# EasyEDA Pro project ProPrj_承载我所有幻想的键盘_2025-02-09.epro, schematic 11-Schematic
Create Date: 2024-01-15; Page Name: P1; Project Name: 智能旋钮; Schematic Name: Schematic2_1; Update Date: 2024-01-15; Company: 嘉立创EDA
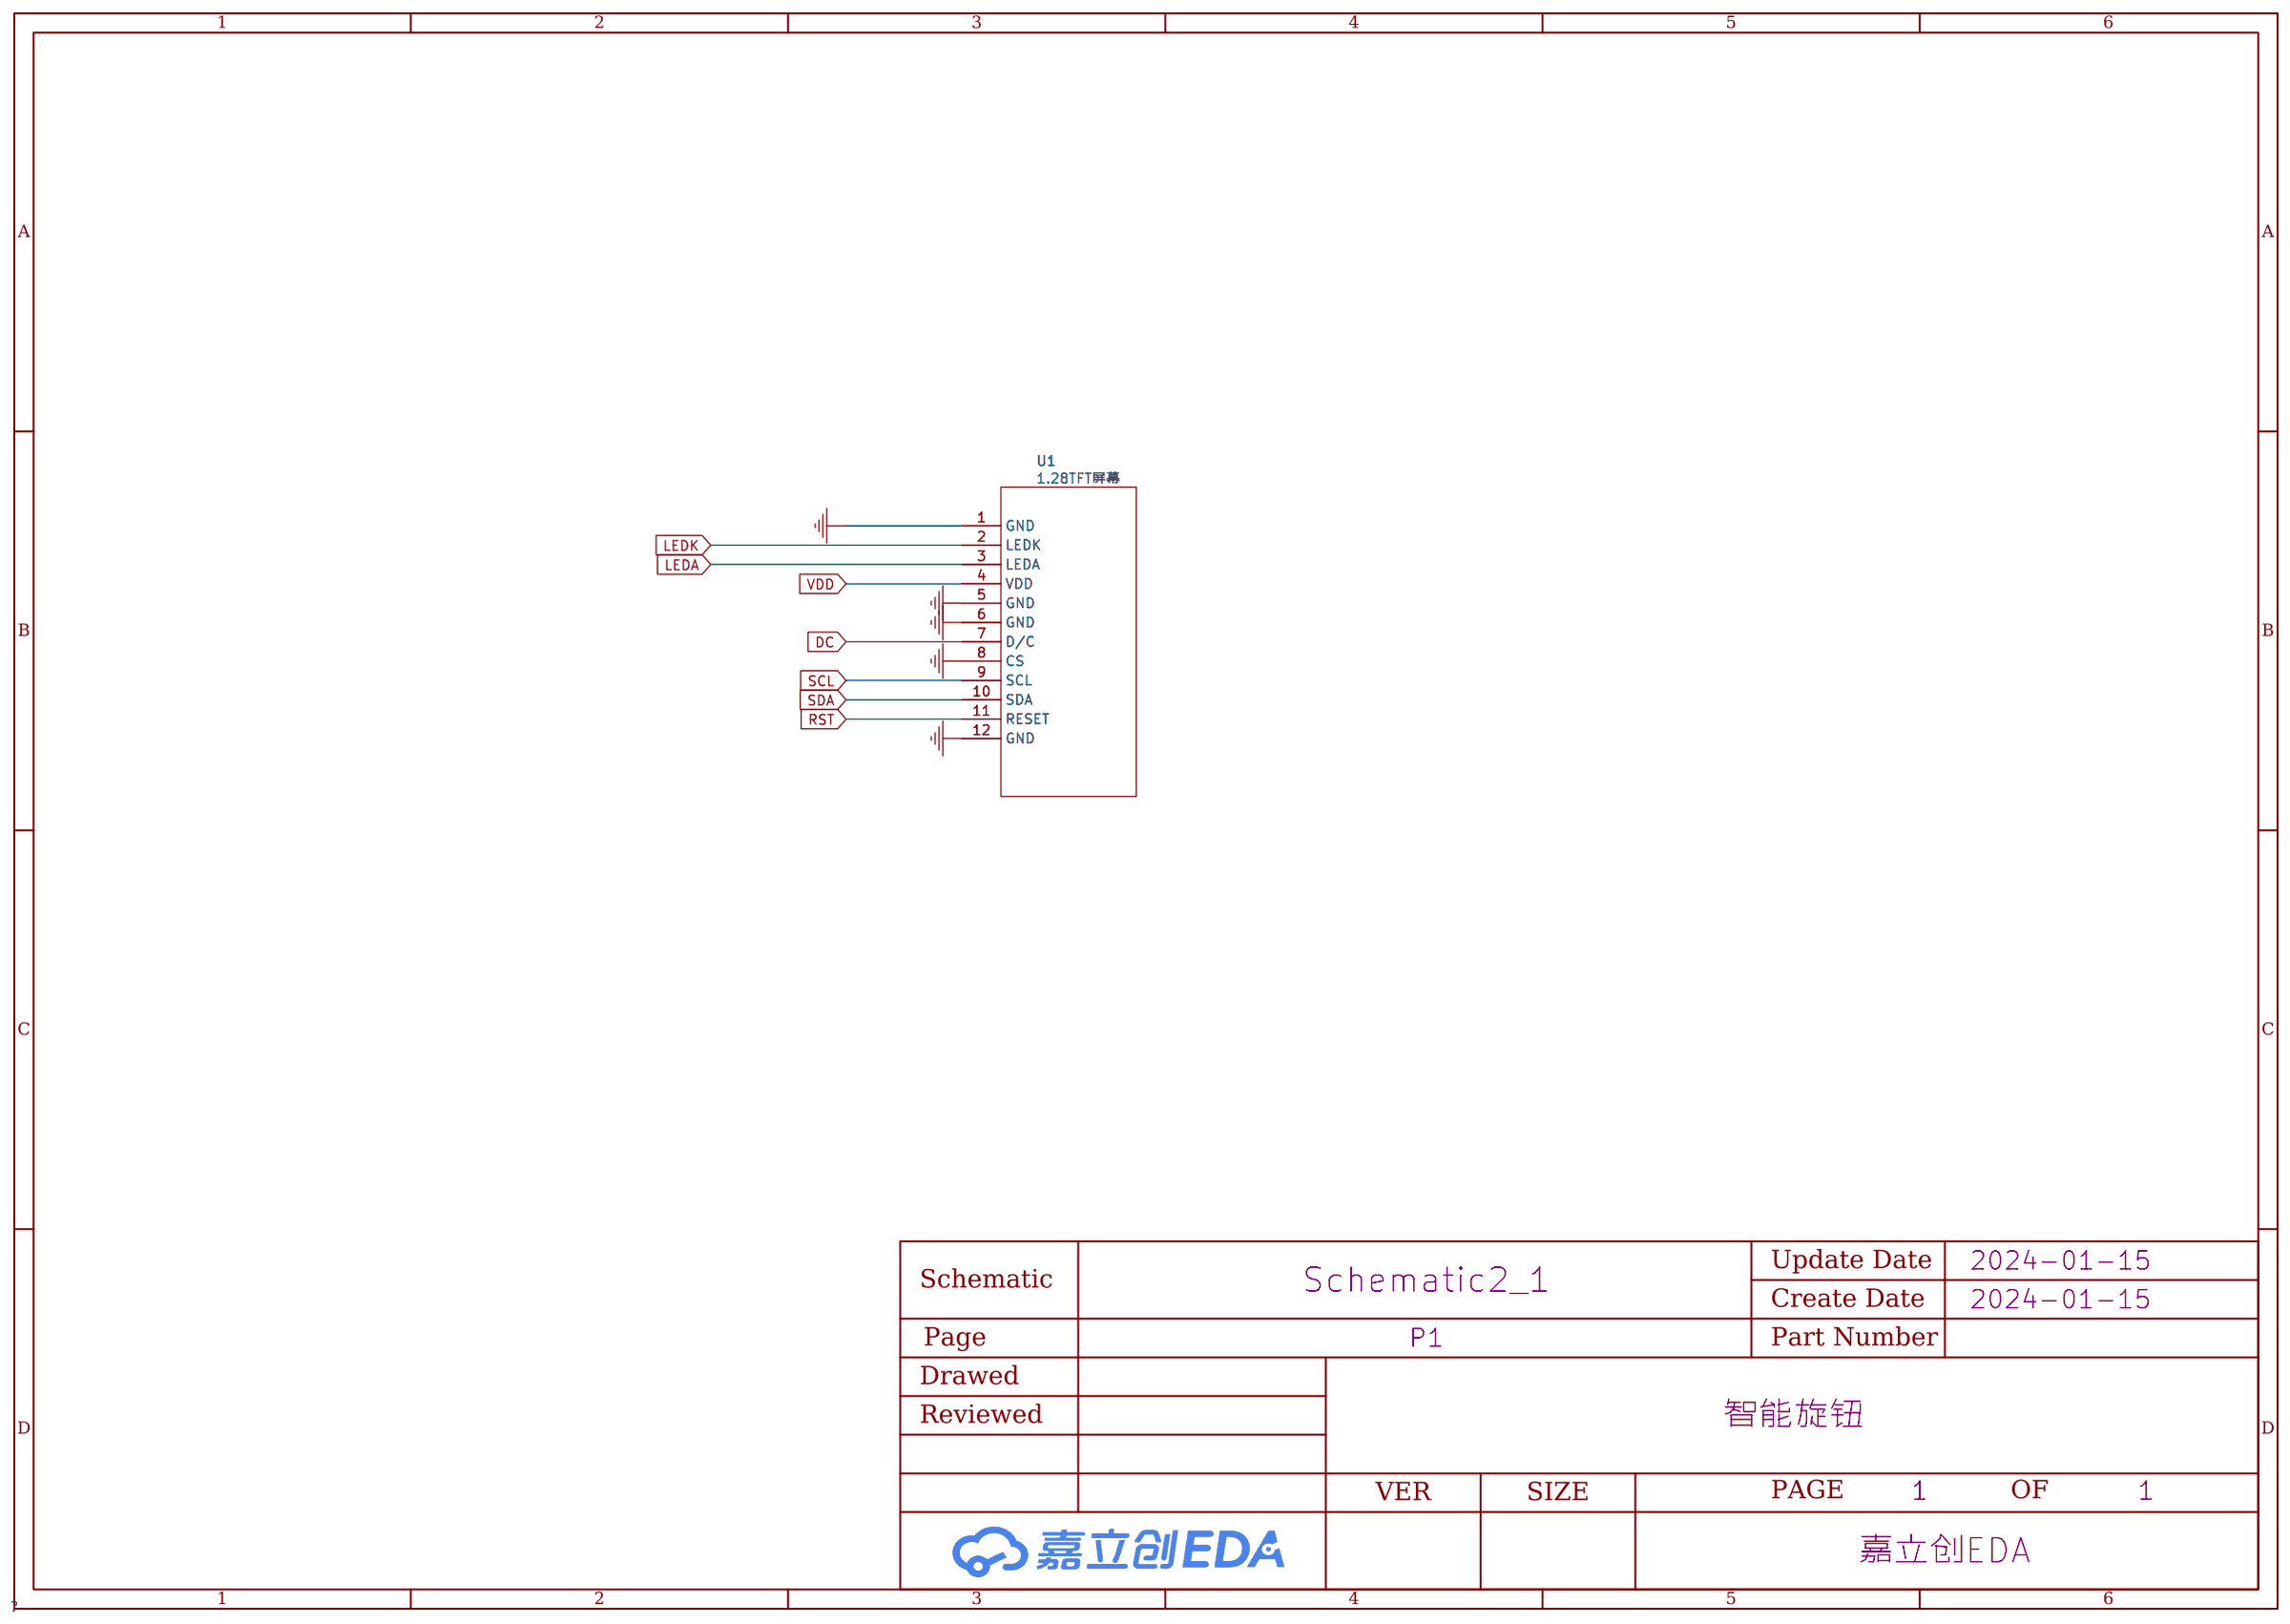
[diagram p24: schematic sheet]

## Parts
U1  1.28TFT屏幕  [1.28TFT屏幕]

## Library data of the parts
U1 = 1.28TFT屏幕

## Nets
GND: U1.1(GND) U1.5(GND) U1.6(GND) U1.8(CS) U1.12(GND)
VDD: U1.4(VDD)
DC: U1.7(D/C)
LEDA: U1.3(LEDA)
LEDK: U1.2(LEDK)
RST: U1.11(RESET)
SCL: U1.9(SCL)
SDA: U1.10(SDA)
